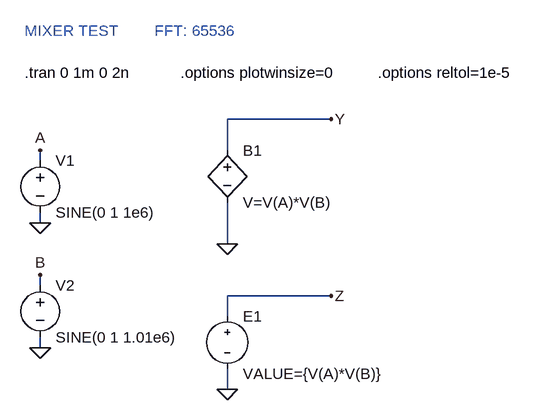
[diagram p0: schematic Mix.asc]
Mix.asc, the LTspice schematic file:
Version 4
SHEET 1 880 680
WIRE 144 144 144 96
WIRE 144 96 304 96
WIRE 144 224 144 288
WIRE -144 240 -144 256
WIRE -144 432 -144 448
WIRE -144 352 -144 336
WIRE -144 160 -144 144
WIRE 144 400 144 368
WIRE 144 368 304 368
WIRE 144 480 144 512
FLAG 144 288 0
FLAG -144 144 A
FLAG -144 336 B
FLAG -144 256 0
FLAG -144 448 0
FLAG 304 96 Y
FLAG 144 512 0
FLAG 304 368 Z
SYMBOL bv 144 128 R0
SYMATTR InstName B1
SYMATTR Value V=V(A)*V(B)
SYMBOL voltage -144 144 R0
WINDOW 123 0 0 Left 0
WINDOW 39 0 0 Left 0
SYMATTR InstName V1
SYMATTR Value SINE(0 1 1e6)
SYMBOL voltage -144 336 R0
WINDOW 123 0 0 Left 0
WINDOW 39 0 0 Left 0
SYMATTR InstName V2
SYMATTR Value SINE(0 1 1.01e6)
SYMBOL Misc\\Epoly 144 384 R0
SYMATTR InstName E1
SYMATTR Value VALUE={V(A)*V(B)}
TEXT -168 24 Left 0 !.tran 0 1m 0 2n
TEXT 72 24 Left 0 !.options plotwinsize=0
TEXT 376 24 Left 0 !.options reltol=1e-5
TEXT -168 -40 Left 0 ;MIXER TEST
TEXT 32 -40 Left 0 ;FFT: 65536

The netlist it stands for:
* Mix.asc
B1 Y 0 V=V(A)*V(B)
V1 A 0 SINE(0 1 1e6)
V2 B 0 SINE(0 1 1.01e6)
E1 Z 0 VALUE={V(A)*V(B)}
.tran 0 1m 0 2n
.options plotwinsize=0
.options reltol=1e-5
* MIXER TEST
* FFT: 65536
.backanno
.end